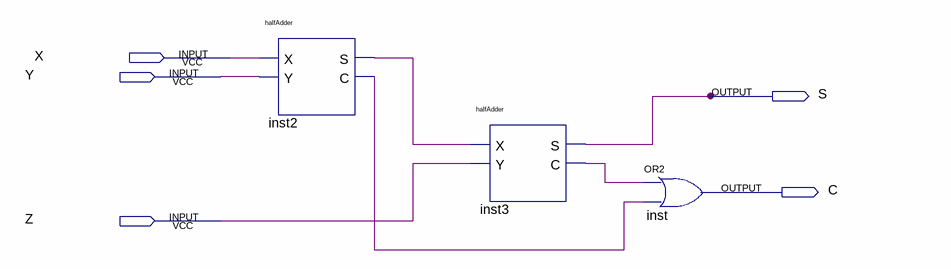
[diagram p0: schematic sheet]
// Quartus schematic fullAdder.bdf as structural Verilog: 3 symbols, 5 pins
module fullAdder (
  input  X,
  input  Y,
  input  Z,
  output S,
  output C
);

  wire inst2_c, inst2_s, inst3_c;

  halfAdder inst2 (.X(X), .Y(Y), .S(inst2_s), .C(inst2_c));
  halfAdder inst3 (.X(inst2_s), .Y(Z), .S(S), .C(inst3_c));
  or inst (C, inst3_c, inst2_c);
endmodule
